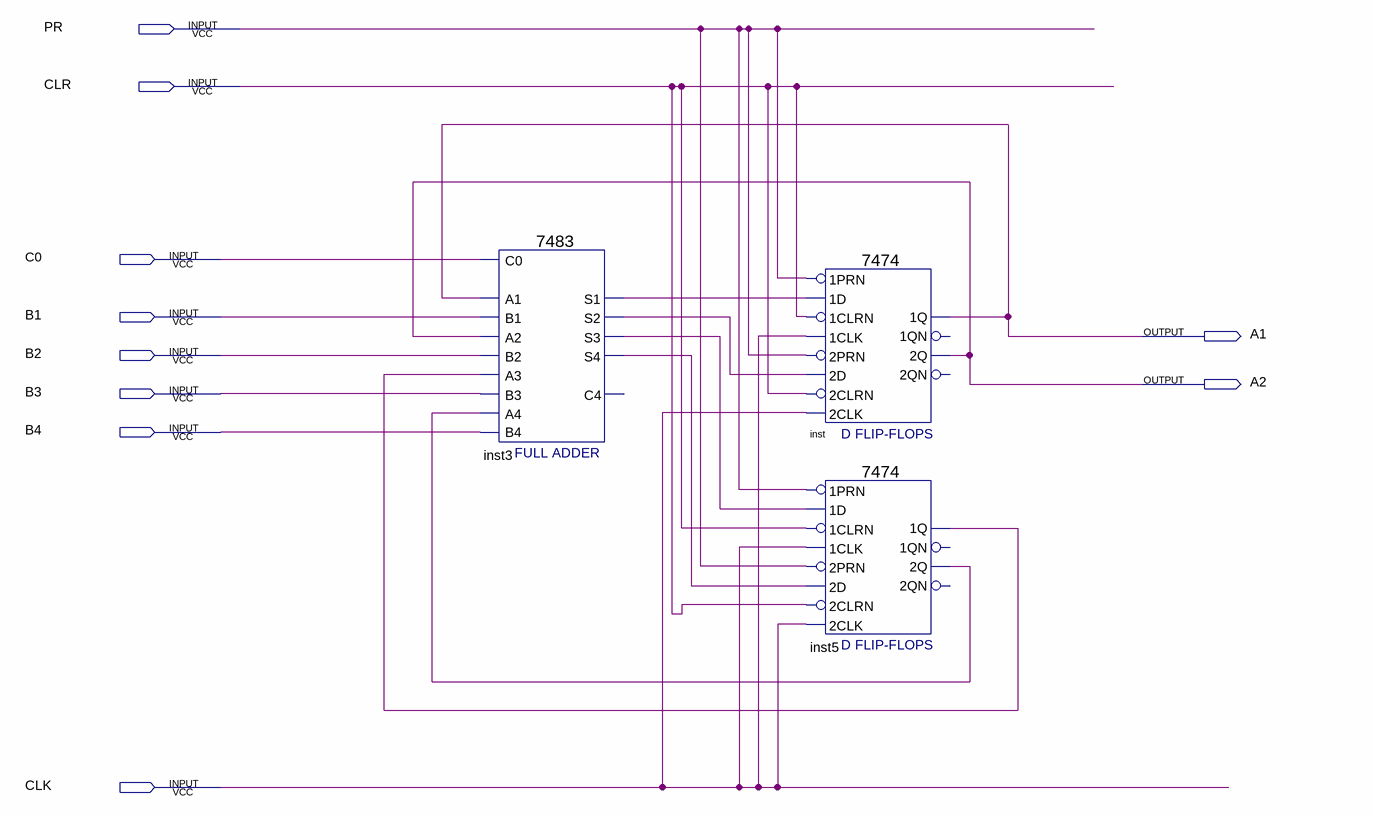
[diagram p0: schematic sheet]
// Quartus schematic Block4.bdf as structural Verilog: 3 symbols, 10 pins
module Block4 (
  input  PR,
  input  CLR,
  input  C0,
  input  B1,
  input  B2,
  input  B3,
  input  B4,
  input  CLK,
  output A1,
  output A2
);

  wire inst3_s1, inst3_s2, inst3_s3, inst3_s4, inst5_1q, inst5_2q;

  \7483  inst3 (
    .B4(B4), .C0(C0), .A1(A1), .A2(A2), .B1(B1), .B2(B2), .A3(inst5_1q), .B3(B3), .A4(inst5_2q),
    .S3(inst3_s3), .S4(inst3_s4), .S2(inst3_s2), .S1(inst3_s1));  // open: C4
  \7474  inst (
    .\2D (inst3_s2), .\2PRN (PR), .\1CLK (CLK), .\1D (inst3_s1), .\1PRN (PR), .\2CLK (CLK), .\2CLRN (CLR),
    .\1CLRN (CLR), .\2Q (A2), .\1Q (A1));  // open: 1QN, 2QN
  \7474  inst5 (
    .\2D (inst3_s4), .\2PRN (PR), .\1CLK (CLK), .\1D (inst3_s3), .\1PRN (PR), .\2CLK (CLK), .\2CLRN (CLR),
    .\1CLRN (CLR), .\2Q (inst5_2q), .\1Q (inst5_1q));  // open: 1QN, 2QN
endmodule
